# EAGLE design mavroOBD (EAGLE 9.1.3)
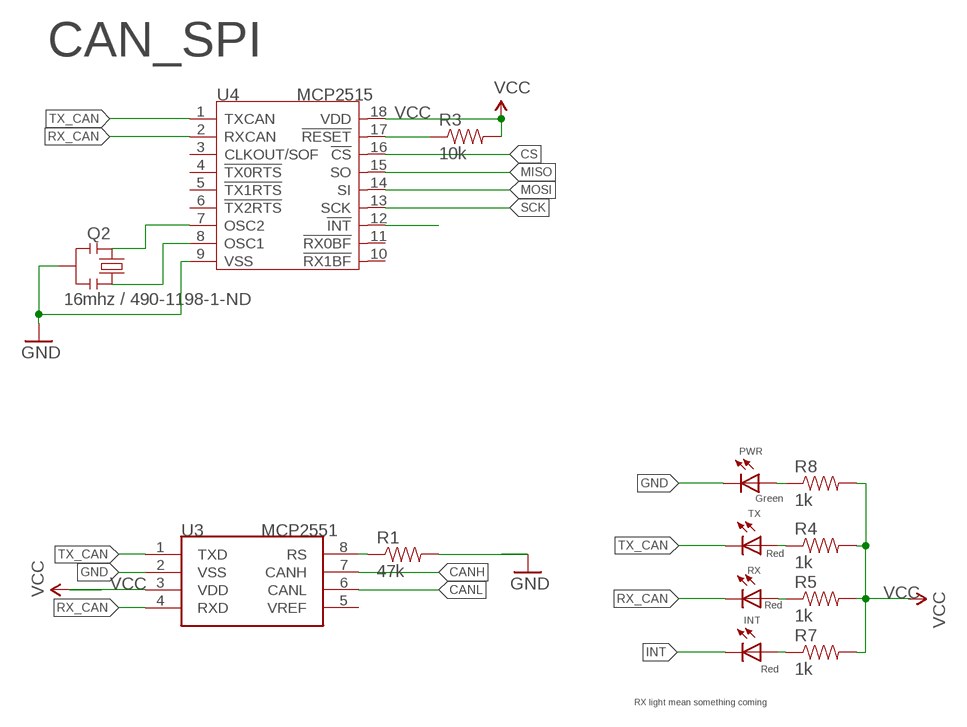
[diagram p0: schematic, sheet 1]

## Parts
INT  Red  LED  [0603-LED-ALT1]
PWR  Green  LED  [0603-LED-ALT1]
Q2  16mhz / 490-1198-1-ND  RESONATOR1:1  [RESONATOR-SMD-1:1]
R1  47k  RESISTOR0603-RES  [0603-RES]
R3  10k  RESISTOR0603-RES  [0603-RES]
R4  1k  RESISTOR0603-RES  [0603-RES]
R5  1k  RESISTOR0603-RES  [0603-RES]
R7  1k  RESISTOR0603-RES  [0603-RES]
R8  1k  RESISTOR0603-RES  [0603-RES]
RX  Red  LED  [0603-LED-ALT1]
TX  Red  LED  [0603-LED-ALT1]
U3  MCP2551  MCP2551-SOIC8  [SOIC8-6.0]
U4  MCP2515  MCP2515-SOIC18  [SOIC18]

## Nets
CANH: U3.7(CANH)
CANL: U3.6(CANL)
CS: U4.16(!CS)
GND [power]: PWR.C Q2.2 R1.2 U3.2(VSS) U4.9(VSS)
INT: INT.C U4.12(!INT)
MISO: U4.15(SO)
MOSI: U4.14(SI)
N$3: R4.1 TX.A
N$5: PWR.A R8.1
N$15: R5.1 RX.A
N$16: Q2.1 U4.7(OSC2)
N$17: Q2.3 U4.8(OSC1)
N$19: INT.A R7.1
N$20: R1.1 U3.8(RS)
RST_N: R3.1 U4.17(!RESET)
RX_CAN: RX.C U3.4(RXD) U4.2(RXCAN)
SCK: U4.13(SCK)
TX_CAN: TX.C U3.1(TXD) U4.1(TXCAN)
VCC: R3.2 R4.2 R5.2 R7.2 R8.2 U3.3(VDD) U4.18(VDD)
Unconnected: U3.5(VREF) U4.3(CLKOUT/SOF) U4.4(!TX0RTS) U4.5(!TX1RTS) U4.6(!TX2RTS) U4.10(!RX1BF) U4.11(!RX0BF)

## Notes on the sheet
- CAN_SPI
- RX light mean something coming

## Library data of the parts
INT PWR RX TX = Testing:LED: LEDs Standard schematic elements and footprints for 5mm, 3mm, 1206, and 0603 sized LEDs. 5mm - Spark Fun Electronics SKU : COM-00529 (and others)
Q2 = Testing:RESONATOR: Resonator Small SMD resonator. This is the itty bitty 10/20MHz resonators with built in caps. CSTCE10M0G55 and CSTCE20M0V53. Footprint for SMD has been used in SFE production for years, and does work okay. 1:1 is an attempt to get larger fillets on the sides so it will be easier to inspect these solders in our AOI machine. The pads have been minimized to match the actual metal under the resonator. To see this relation, it includes an image import of the bottom side of the component. Imported to scale on layer 200.
R1 R3-R5 R7 R8 = SparkFun-Passives:RESISTOR: Resistor Basic schematic elements and footprints for 0603, 1206, and PTH resistors.
U3 = IC:MCP2551: High-Speed CAN Transceiver http://ww1.microchip.com/downloads/en/devicedoc/21667f.pdf
U4 = IC:MCP2515: Stand-Alone CAN Controller With SPI Interface

## Net classes
0 default: width 0.254 mm, drill 0.406 mm, clearance 0.355 mm
1 power: width 0.254 mm, drill 0.711 mm, clearance 0.355 mm to class 0, clearance 0.355 mm
2 gnd: width 0.254 mm, drill 0.711 mm, clearance 0.355 mm to class 0, clearance 0.355 mm to class 1, clearance 0.355 mm

## Board
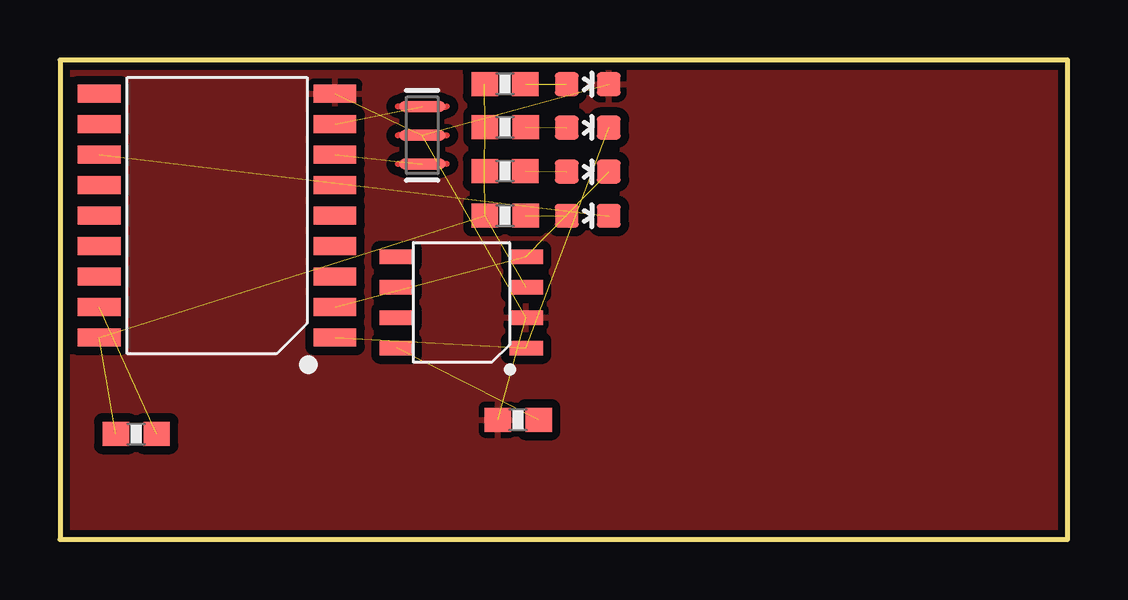
[diagram p1: board, top side]
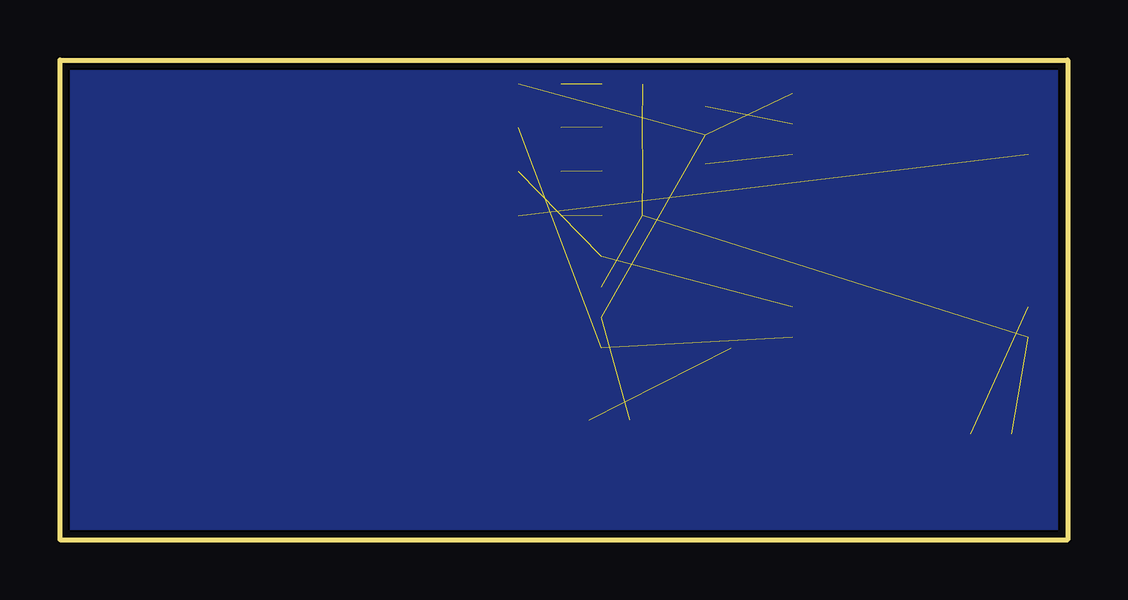
[diagram p2: board, bottom side, seen from below]

Size 42 x 20 mm. Coordinates in mm from the lower left corner, seen from the top.
Outline: 0,20 0,0 42,0 42,20 0,20
Copper layers (1*16): Top 0.035mm / dielectric 1.5mm / Bottom 0.035mm
Design rules "SparkFun-2-layer *": minimum track width 7mil, minimum drill 15mil, track to track 8mil, track to pad 8mil, pad to pad 8mil, via to via 8mil, smd to smd 8mil, copper to edge 8mil, drill to drill 8mil, minimum pad ring 12mil, minimum via ring 10mil, stop-mask expansion 4mil, vias tented up to drill 20mil, thermal gap 10mil

### Footprints (pad centres in the part's own frame; a part is rotated, then mirrored left to right if it is on the bottom)
0603-LED-ALT1 = smd 1 x 1: A 0,-0.877; C 0,0.877
RESONATOR-SMD-1:1 = smd 0.45 x 1.905: 1 -1.2,0; 2 0,0; 3 1.2,0
0603-RES = smd 1.1 x 1: 1 -0.85,0; 2 0.85,0
SOIC8-6.0 = smd 0.6 x 1.4: 1 -1.905,-2.7; 2 -0.635,-2.7; 3 0.635,-2.7; 4 1.905,-2.7; 5 1.905,2.7; 6 0.635,2.7; 7 -0.635,2.7; 8 -1.905,2.7
SOIC18 = smd 0.762 x 1.778: 1 -5.08,-4.915; 2 -3.81,-4.915; 3 -2.54,-4.915; 4 -1.27,-4.915; 5 0,-4.915; 6 1.27,-4.915; 7 2.54,-4.915; 8 3.81,-4.915; 9 5.08,-4.915; 10 5.08,4.915; 11 3.81,4.915; 12 2.54,4.915; 13 1.27,4.915; 14 0,4.915; 15 -1.27,4.915; 16 -2.54,4.915; 17 -3.81,4.915; 18 -5.08,4.915

### Placement (x,y rotation side)
INT  22,13.5 270 top
PWR  22,18.99 270 top
Q2  15.1,16.86 90 top
R1  19.1,5 180 top
R3  3.18,4.41 180 top
R4  18.56,17.2 180 top
R5  18.55,15.37 180 top
R7  18.56,13.51 180 top
R8  18.55,19 180 top
RX  22,15.34 270 top
TX  22,17.18 270 top
U3  16.73,9.89 90 top
U4  6.55,13.51 90 top

### Tracks (layer width: path | path; a pad name or v marks a point on that pad's centre or on a via)
GND  (4 unrouted)
  pour Top (isolate 0.305): 0,20 42,20 42,0 0,0
  pour Bottom (isolate 0.305): 0,20 42,20 42,0 0,0
INT  (1 unrouted)
N$3  (1 unrouted)
N$5  (1 unrouted)
N$15  (1 unrouted)
N$16  (1 unrouted)
N$17  (1 unrouted)
N$19  (1 unrouted)
N$20  (1 unrouted)
RST_N  (1 unrouted)
RX_CAN  (2 unrouted)
TX_CAN  (2 unrouted)
VCC  (6 unrouted)